# EasyEDA Pro project 第十四届蓝桥杯省赛真题.eprj, schematic B1

## Sheets
1 ETH: Create Date: 2023-03-16; Page Name: ETH; Project Name: 14P_2023-3-16; Schematic Name: Schematic1; Update Date: 2023-03-17
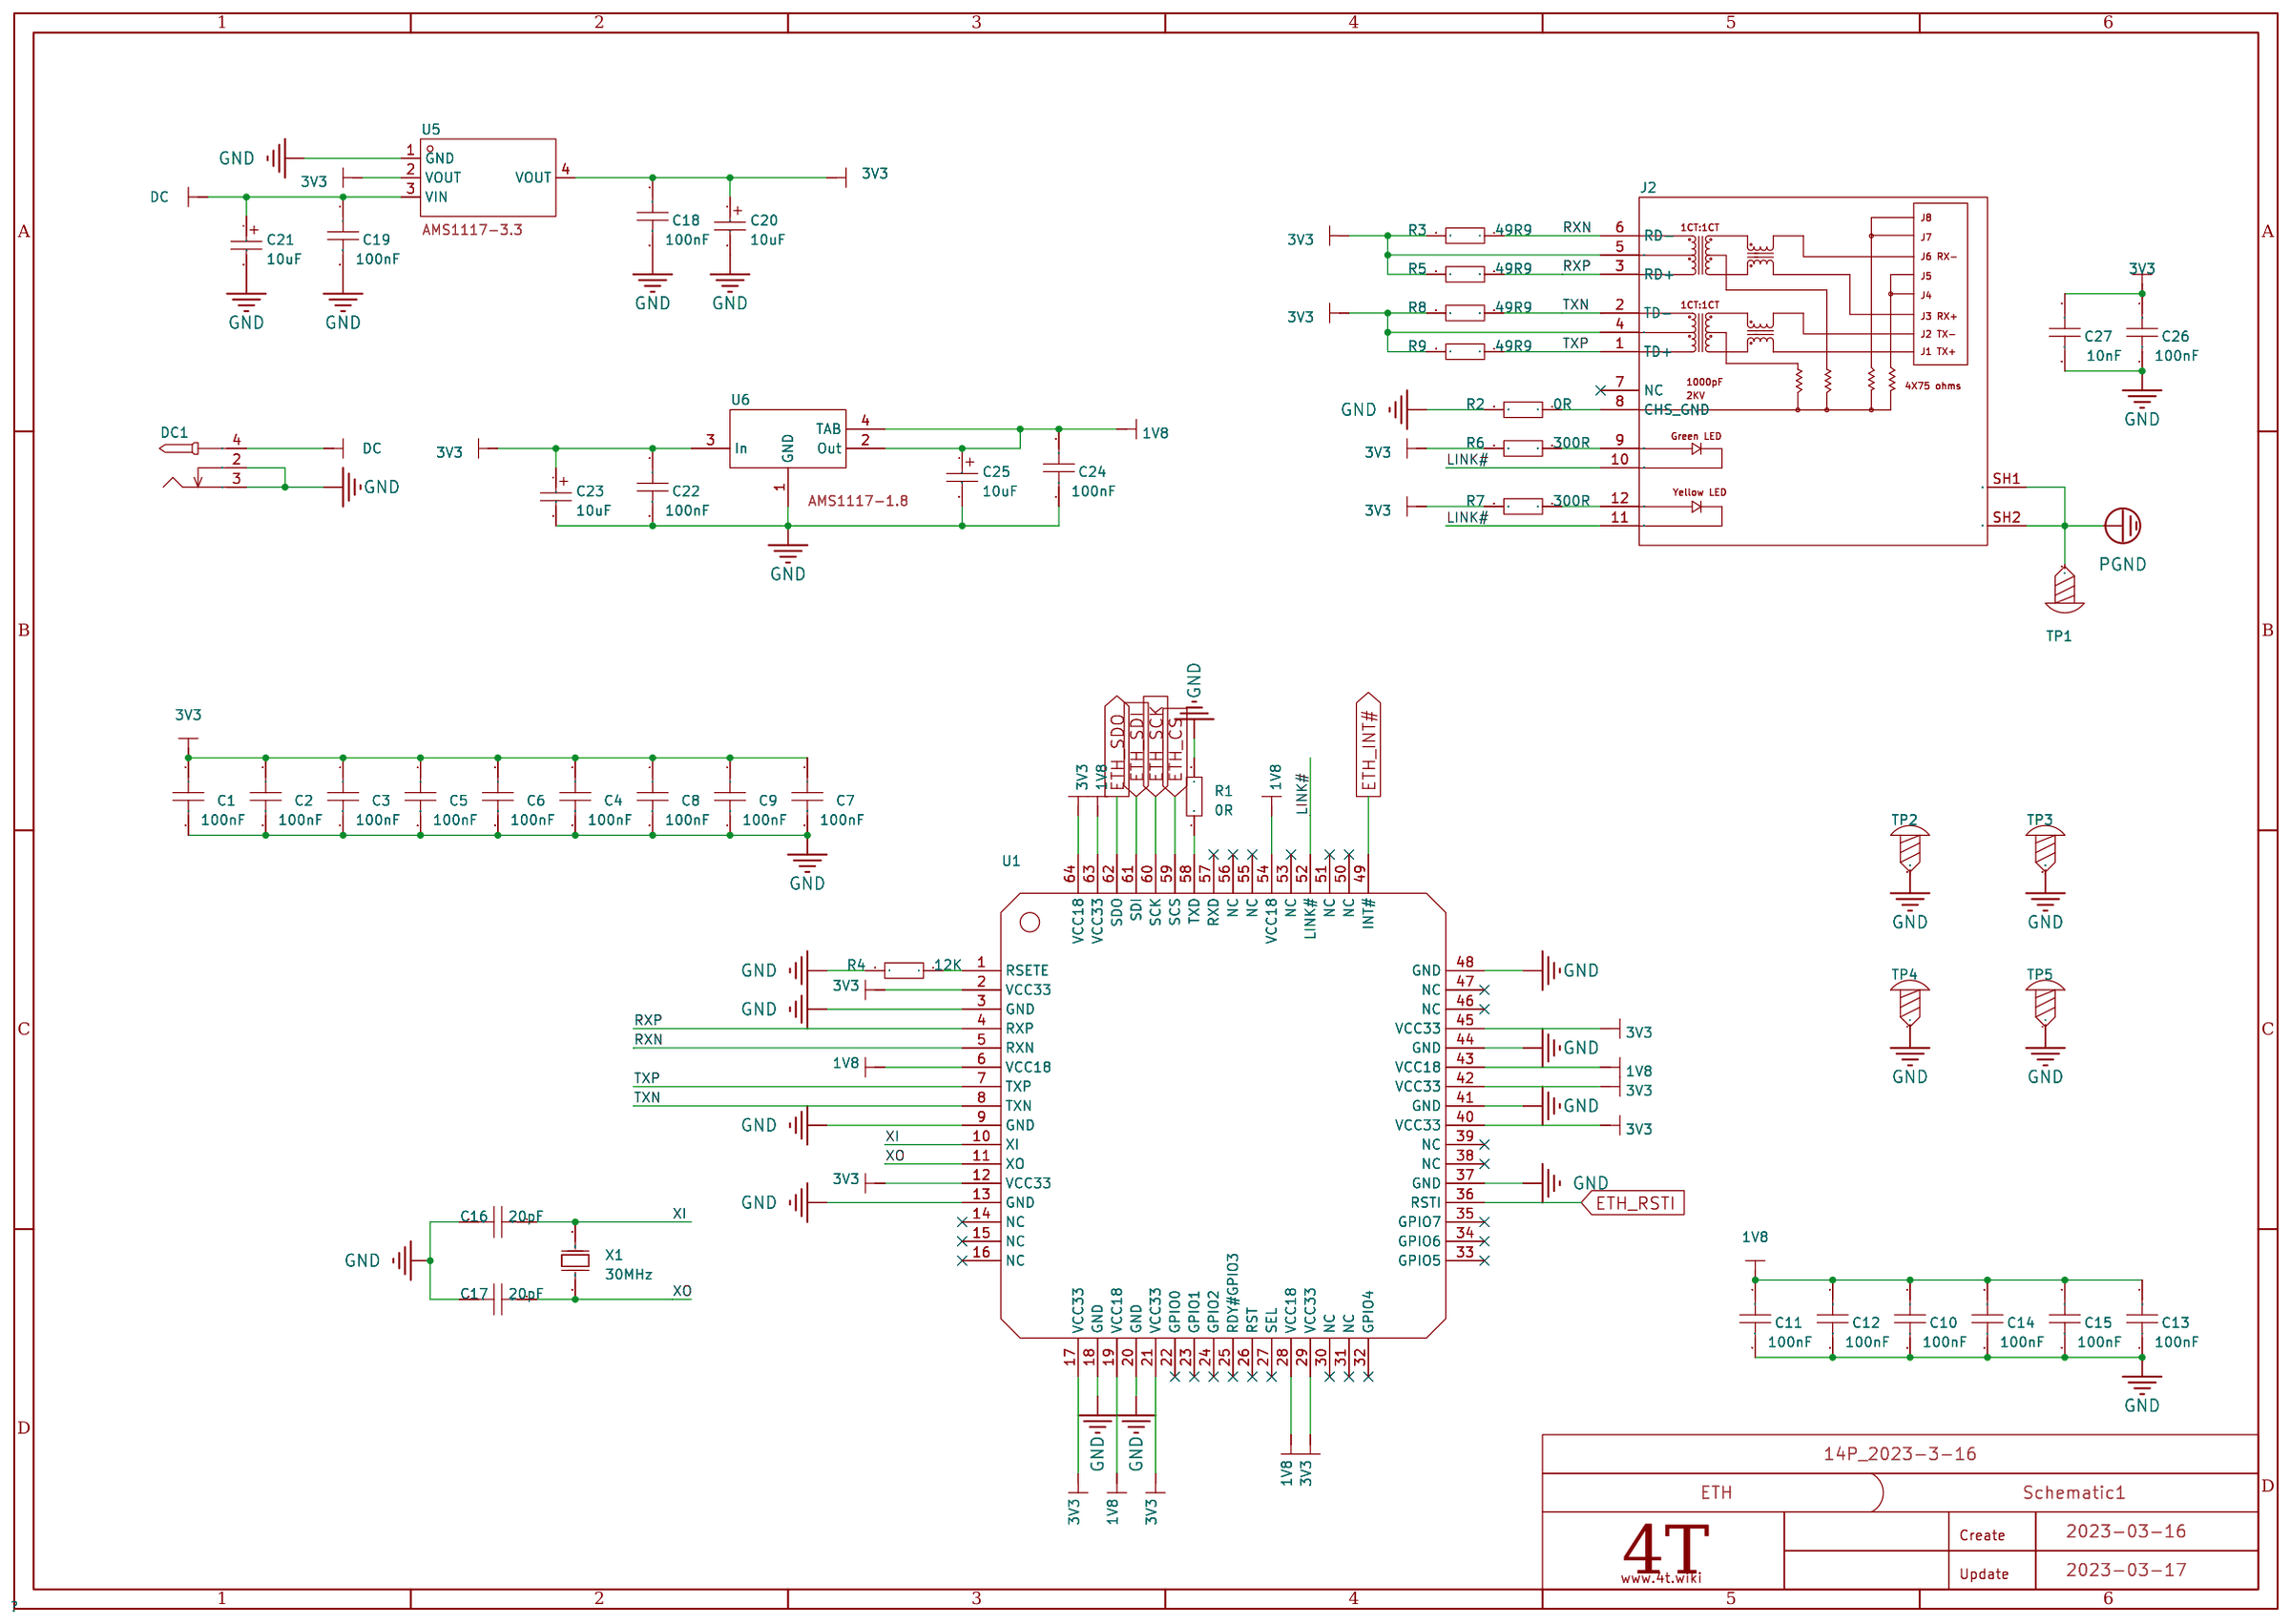
[diagram p0: ETH]
2 MP: Create Date: 2024-04-04; Page Name: MP; Project Name: 第十四届蓝桥杯省赛真题; Schematic Name: B1; Update Date: 2024-04-10
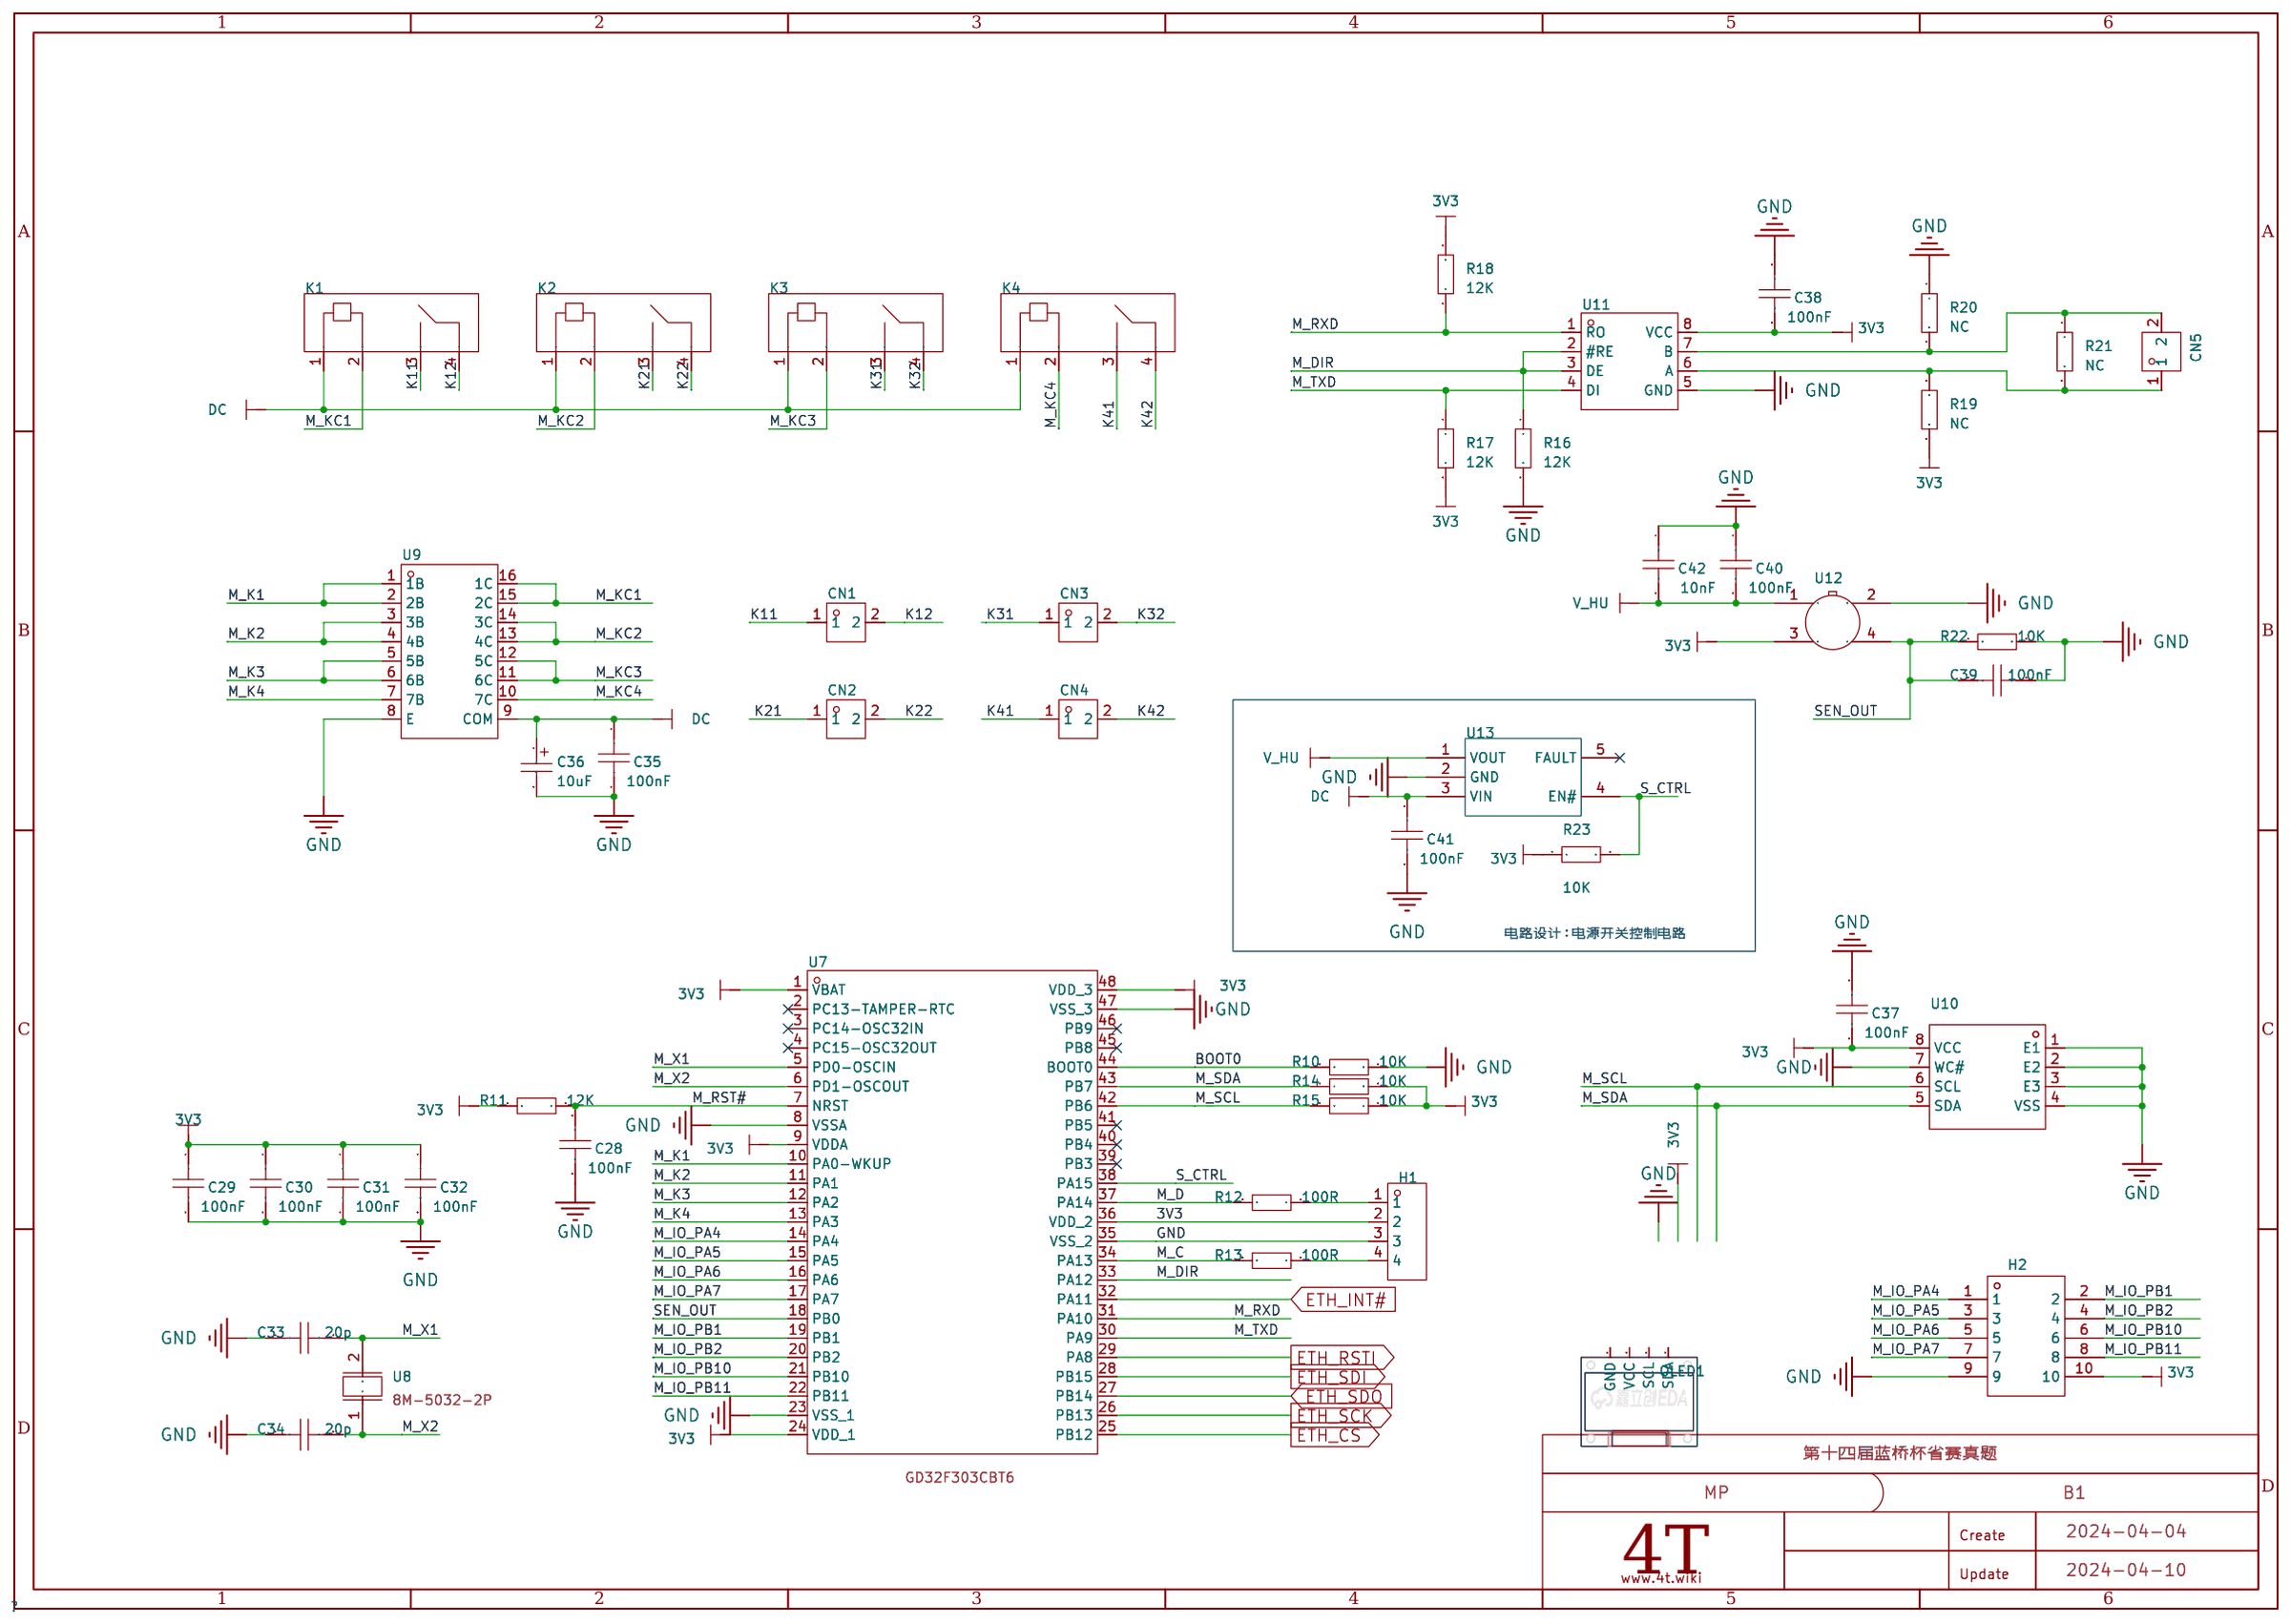
[diagram p1: MP]

## Parts
sheet ETH
C1  100nF  [C0805]
C2  100nF  [C0805]
C3  100nF  [C0805]
C4  100nF  [C0805]
C5  100nF  [C0805]
C6  100nF  [C0805]
C7  100nF  [C0805]
C8  100nF  [C0805]
C9  100nF  [C0805]
C10  100nF  [C0805]
C11  100nF  [C0805]
C12  100nF  [C0805]
C13  100nF  [C0805]
C14  100nF  [C0805]
C15  100nF  [C0805]
C16  20pF  [C0805]
C17  20pF  [C0805]
C18  100nF  [C0805]
C19  100nF  [C0805]
C20  10uF  [C_Ele_SMD_3x5.4mm]
C21  10uF  [C_Ele_SMD_3x5.4mm]
C22  100nF  [C0805]
C23  10uF  [C_Ele_SMD_3x5.4mm]
C24  100nF  [C0805]
C25  10uF  [C_Ele_SMD_3x5.4mm]
C26  100nF  [C0805]
C27  10nF  [C0805]
DC1  -  [DC-2.0]
J2  HY911105AE  [RJ45-TH_HR911105A]
R1  0R  [R0805]
R2  0R  [R0805]
R3  49R9  [R0805]
R4  12K  [R0805]
R5  49R9  [R0805]
R6  300R  [R0805]
R7  300R  [R0805]
R8  49R9  [R0805]
R9  49R9  [R0805]
TP1  -  [M3螺丝]
TP2  -  [M2螺丝]
TP3  -  [M2螺丝]
TP4  -  [M2螺丝]
TP5  -  [M2螺丝]
U1  CH395Q  [LQFP-64_L10.0-W10.0-P0.50-LS12.0-BL]
U5  AMS1117-3.3  [SOT-223-3_L6.5-W3.4-P2.30-LS7.0-BR]
U6  AMS1117-1.8  [SOT-223-4_L6.5-W3.5-P2.30-LS7.0-BR]
X1  30MHz  [OSC-SMD_L5.0-W3.2]
sheet MP
C28  100nF  [C0805]
C29  100nF  [C0805]
C30  100nF  [C0805]
C31  100nF  [C0805]
C32  100nF  [C0805]
C33  20p  [C0805]
C34  20p  [C0805]
C35  100nF  [C0805]
C36  10uF  [C_Ele_SMD_3x5.4mm]
C37  100nF  [C0805]
C38  100nF  [C0805]
C39  100nF  [C0805]
C40  100nF  [C0805]
C41  100nF  [C0805]
C42  10nF  [C0805]
CN1  KF128L-5.08-2P 蓝色  [TH_KF128L-5.08-2P]
CN2  KF128L-5.08-2P 蓝色  [TH_KF128L-5.08-2P]
CN3  KF128L-5.08-2P 蓝色  [TH_KF128L-5.08-2P]
CN4  KF128L-5.08-2P 蓝色  [TH_KF128L-5.08-2P]
CN5  KF128L-5.08-2P 蓝色  [TH_KF128L-5.08-2P]
H1  -  [HDR-TH_4P-P2.54-V-F]
H2  -  [HDR-TH_10P-P2.54-V-M-R2-C5-S2.54]
K1  HF49FD/012-1H12  [RELAY-TH_HF49FD-XXX-1H12-XXX]
K2  HF49FD/012-1H12  [RELAY-TH_HF49FD-XXX-1H12-XXX]
K3  HF49FD/012-1H12  [RELAY-TH_HF49FD-XXX-1H12-XXX]
K4  HF49FD/012-1H12  [RELAY-TH_HF49FD-XXX-1H12-XXX]
OLED1  -  [0.96OLED_4P]
R10  10K  [R0805]
R11  12K  [R0805]
R12  100R  [R0805]
R13  100R  [R0805]
R14  10K  [R0805]
R15  10K  [R0805]
R16  12K  [R0805]
R17  12K  [R0805]
R18  12K  [R0805]
R19  NC  [R0805]
R20  NC  [R0805]
R21  NC  [R0805]
R22  10K  [R0805]
R23  10K  [R0805]
U7  GD32F303CBT6  [LQFP-48_L7.0-W7.0-P0.50-LS9.0-BL]
U8  8M-5032-2P  [CRYSTAL-SMD_L5.0-W3.2]
U9  ULN2003  [SOIC-16_L9.9-W3.9-P1.27-LS6.0-BL]
U10  M24C02-WMN6TP  [SOIC-8_L4.9-W3.9-P1.27-LS6.0-BL]
U11  MAX3485ESA  [SOP-8_L5.0-W4.0-P1.27-LS6.0-BL]
U12  MP-2  [SENSOR-TH_MP-5]
U13  -  [SOT_PDS]

## Library data of the parts
C1-C19 C22 C24 C26-C35 C37-C42 = CAP_0603: Supplier Footprint: 0603
C20 C21 C23 C25 C36 = C_Ele_SMD_3x5.4mm: Supplier Footprint: SMD,3x5.4mm
DC1 = DC-005_2.0: Supplier Footprint: 插件
J2 = HY911105AE: 连接器类型:RJ插座;USOC代码:RJ45;端口数量:1;等级:-;屏蔽:-;LED:-;; LCSC Part Name: RJ45 带变压器; Supplier Part: C69427; Manufacturer: HANRUN(汉仁); Supplier Footprint: 插件; JLCPCB Part Class: 扩展库; Datasheet: https://atta.szlcsc.com/upload/public/pdf/source/20160507/1462613611469.pdf; Supplier: LCSC; Connector Type: RJ插座; USOC Codes: RJ45; Number of Ports: 1
R1-R23 = Res_0805: Supplier Footprint: 0805
TP1 = M3螺丝: Supplier Footprint: 插件
TP2-TP5 = M2螺丝: Supplier Footprint: 插件
U1 = CH395Q: 应用功能:以太网控制器;通道数:-;接口类型:Parallel, SPI, UART;电源电压:1.65V~3.6V;电源电流:90mA;; Supplier Part: C87390; Manufacturer: WCH(南京沁恒); Supplier Footprint: LQFP-64(10x10); JLCPCB Part Class: 扩展库; Datasheet: https://atta.szlcsc.com/upload/public/pdf/source/20200903/C87390_2BA27438C515B4B897A780BE99160E01.pdf; Supplier: LCSC; Application Function: 以太网控制器; Interface: Parallel, SPI, UART; Supply Voltage: 1.65V~3.6V; Supply Current: 90mA
U5 = AMS1117-3.3_C6186: 输出类型:固定;输出极性:正;输出通道数:1;最大输入电压:-;输出电压:3.3V;压差:1.3V@(800mA);静态电流(地电流):-;输出电流:1A;电源纹波抑制比(PSRR):72dB@(120Hz);噪声:-;特性:-;工作温度:-;; LCSC Part Name: 正 Vout=3.3V 1A 72dB@(120Hz); Supplier Part: C6186; Manufacturer: AMS; Supplier Footprint: SOT-223-3; JLCPCB Part Class: 基础库; Datasheet: https://atta.szlcsc.com/upload/public/pdf/source/20180727/C6186_7A095716F0823C02F1997A905E26C086.pdf; Supplier: LCSC; Output Type: 固定; Output Polarity: 正; Number of Outputs: 1; Output Voltage: 3.3V; Dropout Voltage: 1.3V@(800mA); Output Current: 1A; Power Supply Rejection Ratio (PSRR): 72dB@(120Hz)
U6 = AMS1117-1.8_C6185: 输出类型:固定;输出极性:正;输出通道数:1;最大输入电压:15V;输出电压:1.8V~1.8V;压差:1.3V@(1A);输出电流:1A;电源纹波抑制比(PSRR):75dB@(120Hz);; LCSC Part Name: 正 Vin=15V Vout=1.8V~1.8V 1A 75dB@(120Hz); Supplier Part: C6185; Manufacturer: AMS; Supplier Footprint: SOT-223-4; JLCPCB Part Class: 扩展库; Datasheet: https://atta.szlcsc.com/upload/public/pdf/source/20180727/C6186_7A095716F0823C02F1997A905E26C086.pdf; Supplier: LCSC; Output Type: 固定; Output Polarity: 正; Number of Outputs: 1; Maximum Input Voltage: 15V; Output Voltage: 1.8V~1.8V; Dropout Voltage: 1.3V@(1A); Output Current: 1A; Power Supply Rejection Ratio (PSRR): 75dB@(120Hz)
X1 = X503230MSB2GI: 晶振类型:贴片无源晶振;频率:30MHz;频率公差:±10ppm;频率稳定度:±50ppm;负载电容:20pF;工作温度:-40℃~+85℃;; LCSC Part Name: YSX530GA 30MHz ±10ppm 20pF; Supplier Part: C112563; Manufacturer: YXC(扬兴晶振); Supplier Footprint: SMD5032-2P; JLCPCB Part Class: 扩展库; Datasheet: https://atta.szlcsc.com/upload/public/pdf/source/20210329/C112559_847D3CACBA33ACCEB57DEA3AEBB187A1.pdf; Supplier: LCSC; Crystal Type: 贴片无源晶振; Frequency Tolerance: ±10ppm; Frequency Stability: ±50ppm; Load Capacitance: 20pF; Operating Temperature: -40℃~+85℃
CN1-CN5 = KF128L-5.08-2P 蓝色: Supplier Part: C2916931; Supplier Footprint: 5.08-2P; JLCPCB Part Class: 扩展库; Supplier: LCSC
H1 = HDR-F_2.54_1x4P: Supplier Part: C2718488; Supplier Footprint: 插件
H2 = HDR-M_2.54_2x5: Supplier Part: C124387; Supplier Footprint: 插件,P=2.54mm
K1-K4 = HF49FD/012-1H12: 线圈电压:12V;线圈类型:非极化-单线圈;触点形式:一组常开:1A(单刀单掷-常开);最大切换电流:5A;触点材料:AgNi;; LCSC Part Name: 宏发继电器; Supplier Part: C399491; Manufacturer: HF(宏发); Supplier Footprint: SIP-4; JLCPCB Part Class: 扩展库; Datasheet: https://atta.szlcsc.com/upload/public/pdf/source/20190620/C399491_B2190B02DDD565265172868420E7880D.pdf; Supplier: LCSC; Coil Voltage: 12V; Coil Type: 非极化-单线圈; Pin Number: 4; Contact Form: 一组常开:1A(单刀单掷-常开); Maximum Switching Current: 5A; Maximum Switching Voltage: 250V@AC；30V@DC; Coil Rated Power: 120mW; Contact Rating: 5A@30VDC；5A@250VAC; Coil Resistance: 1.2kΩ; Operate Time: 10ms; Release Time: 5ms; Contact Resistance: 100mΩ; Contact Material: AgNi; Operating Temperature: -40℃~+85℃
OLED1 = 0.96OLED模块_4P: Supplier Footprint: 插件
U7 = GD32F303CBT6_C3013779: CPU内核:ARM Cortex-M4;CPU最大主频:120MHz;工作电压范围:-;程序存储容量:128KB;RAM总容量:32KB;EEPROM/数据 FLASH容量:128KB;GPIO端口数量:37;ADC(位数):12bit;DAC(位数):12bit;(E)PWM(位数):-;8位Timer数量:-;16位Timer数量:7;32位Timer数量:-;CAN路数:1;U(S)ART路数:3;I2C路数:2;I2S路数:2;(Q)SPI路数:3;外设/功能:看门狗；RTC实时时钟;内部振荡器:; LCSC Part Name: ARM Cortex-M4 120MHz; Supplier Part: C3013779; Manufacturer: GigaDevice(兆易创新); Supplier Footprint: LQFP-48(7x7); JLCPCB Part Class: 扩展库; Datasheet: https://atta.szlcsc.com/upload/public/pdf/source/20220624/E1A57ED816B162D6D1424864911A792F.pdf; Supplier: LCSC; CPU Core: ARM Cortex-M4; CPU Maximum Speed: 120MHz; Program Storage Size: 128KB; Program Memory Type: FLASH; RAM Size: 32KB; EEPROM: 128KB; GPIO Ports Number: 37; ADC (Bit): 12bit; DAC (Bit): 12bit; 16Bit Timer: 7; CAN: 1; UART/USART: 3; I2C: 2; I2S: 2; SPI: 3; Peripheral/Function: 看门狗；RTC实时时钟; Watchdog: 有; Real-Time Clock: 有
U8 = 8M-5032-2P: Supplier Part: C9900017580; Supplier Footprint: 8MHz; JLCPCB Part Class: 扩展库; Supplier: LCSC
U9 = ULN2003: 开态输入电压(VI(on)@Vce,Ic):3V@2V,300mA;集射极饱和压降(VCE(sat)@Ii,Ic):1.2V@500uA,350mA;输出漏电流(Icex@Vce):50uA@50V;开态输入电流(Ii@Vi):-;关态输入电流(Ii(off)@Vce,Ic):65uA@50V,500uA;嵌位二极管漏电流(IR@VR):50uA@50V;嵌位二极管正向压降(VF@IF):1.7V@350mA;输入电容(Ci):15pF;工作温度:-20℃~+85℃;; Supplier Part: C688859; Manufacturer: IDCHIP(英锐芯); Supplier Footprint: SOIC-16; JLCPCB Part Class: 扩展库; Datasheet: https://atta.szlcsc.com/upload/public/pdf/source/20210302/C688859_5C67C6CBB0EA78EF92AFC966B53E1AD0.pdf; Supplier: LCSC; ON-state input   voltage(VI(on)@Vce,Ic): 3V@2V,300mA; Collector-emitter   saturation voltage (VCE(sat)@Ii,Ic): 1.2V@500uA,350mA; Output leakage current (Icex@Vce): 50uA@50V; Off-state input current (Ii(off)@Vce,Ic): 65uA@50V,500uA; Clamp Diode Leakage Current (IR@VR): 50uA@50V; Clamp Diode Forward Voltage (VF@IF): 1.7V@350mA; Input Capacitance (Ci): 15pF; Operating Temperature: -20℃~+85℃
U10 = M24C02-WMN6TP: 2-Kbit(256 x 8bit)，I2C接口，工作电压：2.5V to 5.5V; Supplier Part: C7562; Manufacturer: ST(意法半导体); Supplier Footprint: SOIC-8; JLCPCB Part Class: 基础库; Datasheet: https://atta.szlcsc.com/upload/public/pdf/source/20140724/1457707167301.pdf; Supplier: LCSC
U11 = MAX3485ESA: Supplier Part: C668204; Manufacturer: UMW(广东友台半导体); Supplier Footprint: SOP-8; JLCPCB Part Class: 扩展库; Datasheet: https://atta.szlcsc.com/upload/public/pdf/source/20221009/BC018EFD0F414E24649E284F574E449C.pdf; Supplier: LCSC
U12 = MP-2: Supplier Part: C242497; Manufacturer: Winsen(炜盛); Supplier Footprint: 插件; JLCPCB Part Class: 扩展库; Datasheet: https://atta.szlcsc.com/upload/public/pdf/source/20180704/C242497_B8D2418C2743DA3210851F2FB82DA8BD.pdf; Supplier: LCSC
U13 = PDS

## Nets
1V8: C10.1 C11.1 C12.1 C13.1 C14.1 C15.1 C24.1 C25.1 U1.6(VCC18) U1.19(VCC18) U1.28(VCC18) U1.43(VCC18) U1.54(VCC18) U1.63(VCC33) U6.2(Out) U6.4(TAB)
3V3: C1.1 C2.1 C3.1 C4.1 C5.1 C6.1 C7.1 C8.1 C9.1 C18.1 C20.1 C22.1 C23.1 C26.1 C27.1 C29.1 C30.1 C31.1 C32.1 C37.2 C38.2 H1.2 H2.10 J2.4 J2.5 R3.2 R5.2 R6.2 R7.2 R8.2 R9.2 R11.2 R14.2 R15.1 R17.2 R18.1 R19.2 R23.1 U1.2(VCC33) U1.12(VCC33) U1.17(VCC33) U1.21(VCC33) U1.29(VCC33) U1.40(VCC33) U1.42(VCC33) U1.45(VCC33) U1.64(VCC18) U5.2(VOUT) U5.4(VOUT) U6.3(In) U7.1(VBAT) U7.9(VDDA) U7.24(VDD_1) U7.36(VDD_2) U7.48(VDD_3) U10.8(VCC) U11.8(VCC) U12.3
GND: C1.2 C2.2 C3.2 C4.2 C5.2 C6.2 C7.2 C8.2 C9.2 C10.2 C11.2 C12.2 C13.2 C14.2 C15.2 C16.1 C17.1 C18.2 C19.2 C20.2 C21.2 C22.2 C23.2 C24.2 C25.2 C26.2 C27.2 C28.2 C29.2 C30.2 C31.2 C32.2 C33.1 C34.1 C35.2 C36.2 C37.1 C38.1 C39.2 C40.1 C41.2 C42.1 DC1.2 DC1.3 H1.3 H2.9 R1.2 R2.2 R4.2 R10.1 R16.2 R20.1 R22.2 TP2.1 TP3.1 TP4.1 TP5.1 U1.3(GND) U1.9(GND) U1.13(GND) U1.18(GND) U1.20(GND) U1.37(GND) U1.41(GND) U1.44(GND) U1.48(GND) U5.1(GND) U6.1(GND) U7.8(VSSA) U7.23(VSS_1) U7.35(VSS_2) U7.47(VSS_3) U9.8(E) U10.1(E1) U10.2(E2) U10.3(E3) U10.4(VSS) U10.7(WC#) U11.5(GND) U12.2 U13.2(GND)
PGND: J2.SH1 J2.SH2 TP1.1
BOOT0: R10.2 U7.44(BOOT0)
DC: C19.1 C21.1 C35.1 C36.1 C41.1 DC1.4 K1.1 K2.1 K3.1 K4.1 U5.3(VIN) U9.9(COM) U13.3(VIN)
ETH_CS: U1.59(SCS) U7.25(PB12)
ETH_INT#: U1.49(INT#) U7.32(PA11)
ETH_RSTI: U1.36(RSTI) U7.29(PA8)
ETH_SCK: U1.60(SCK) U7.26(PB13)
ETH_SDI: U1.61(SDI) U7.28(PB15)
ETH_SDO: U1.62(SDO) U7.27(PB14)
K11: CN1.1 K1.3
K12: CN1.2 K1.4
K21: CN2.1 K2.3
K22: CN2.2 K2.4
K31: CN3.1 K3.3
K32: CN3.2 K3.4
K41: CN4.1 K4.3
K42: CN4.2 K4.4
LINK#: J2.10 J2.11 U1.52(LINK#)
M_C: R13.2 U7.34(PA13)
M_D: R12.2 U7.37(PA14)
M_DIR: R16.1 U7.33(PA12) U11.2(#RE) U11.3(DE)
M_IO_PA4: H2.1 U7.14(PA4)
M_IO_PA5: H2.3 U7.15(PA5)
M_IO_PA6: H2.5 U7.16(PA6)
M_IO_PA7: H2.7 U7.17(PA7)
M_IO_PB1: H2.2 U7.19(PB1)
M_IO_PB2: H2.4 U7.20(PB2)
M_IO_PB10: H2.6 U7.21(PB10)
M_IO_PB11: H2.8 U7.22(PB11)
M_K1: U7.10(PA0-WKUP) U9.1(1B) U9.2(2B)
M_K2: U7.11(PA1) U9.3(3B) U9.4(4B)
M_K3: U7.12(PA2) U9.5(5B) U9.6(6B)
M_K4: U7.13(PA3) U9.7(7B)
M_KC1: K1.2 U9.15(2C) U9.16(1C)
M_KC2: K2.2 U9.13(4C) U9.14(3C)
M_KC3: K3.2 U9.11(6C) U9.12(5C)
M_KC4: K4.2 U9.10(7C)
M_RST#: C28.1 R11.1 U7.7(NRST)
M_RXD: R18.2 U7.31(PA10) U11.1(RO)
M_SCL: R15.2 U7.42(PB6) U10.6(SCL)
M_SDA: R14.1 U7.43(PB7) U10.5(SDA)
M_TXD: R17.1 U7.30(PA9) U11.4(DI)
M_X1: C33.2 U7.5(PD0-OSCIN) U8.2
M_X2: C34.2 U7.6(PD1-OSCOUT) U8.1
RXN: J2.6(RD-) R3.1 U1.5(RXN)
RXP: J2.3(RD+) R5.1 U1.4(RXP)
S_CTRL: R23.2 U7.38(PA15) U13.4(EN#)
SEN_OUT: C39.1 R22.1 U7.18(PB0) U12.4
TXN: J2.2(TD-) R8.1 U1.8(TXN)
TXP: J2.1(TD+) R9.1 U1.7(TXP)
V_HU: C40.2 C42.2 U12.1 U13.1(VOUT)
XI: C16.2 U1.10(XI) X1.2(OSC2)
XO: C17.2 U1.11(XO) X1.1(OSC1)
$1N6890: R4.1 U1.1(RSETE)
$1N7627: R1.1 U1.58(TXD)
$1N10654: J2.8(CHS GND) R2.1
$1N10919: J2.12 R7.1
$1N10952: J2.9 R6.1
$2N5291: H1.1 R12.1
$2N5344: H1.4 R13.1
$2N14954: CN5.2 R20.2 R21.1 U11.7(B)
$2N14989: CN5.1 R19.1 R21.2 U11.6(A)

Not connected (* = marked no-connect by the designer): J2 7(NC)*; OLED1 1(GND) 2(VCC) 3(SCL) 4(SDA); U1 14(NC)* 15(NC)* 16(NC)* 22(GPIO0)* 23(GPIO1)* 24(GPIO2)* 25(RDY#GPIO3)* 26(RST)* 27(SEL)* 30(NC)* 31(NC)* 32(GPIO4)* 33(GPIO5)* 34(GPIO6)* 35(GPIO7)* 38(NC)* 39(NC)* 46(NC)* 47(NC)* 50(NC)* 51(NC)* 53(NC)* 55(NC)* 56(NC)* 57(RXD)*; U7 2(PC13-TAMPER-RTC)* 3(PC14-OSC32IN)* 4(PC15-OSC32OUT)* 39(PB3)* 40(PB4)* 41(PB5)* 45(PB8)* 46(PB9)*; U13 5(FAULT)*

## Notes on the sheets
sheet 2
- 电路设计：电源开关控制电路
